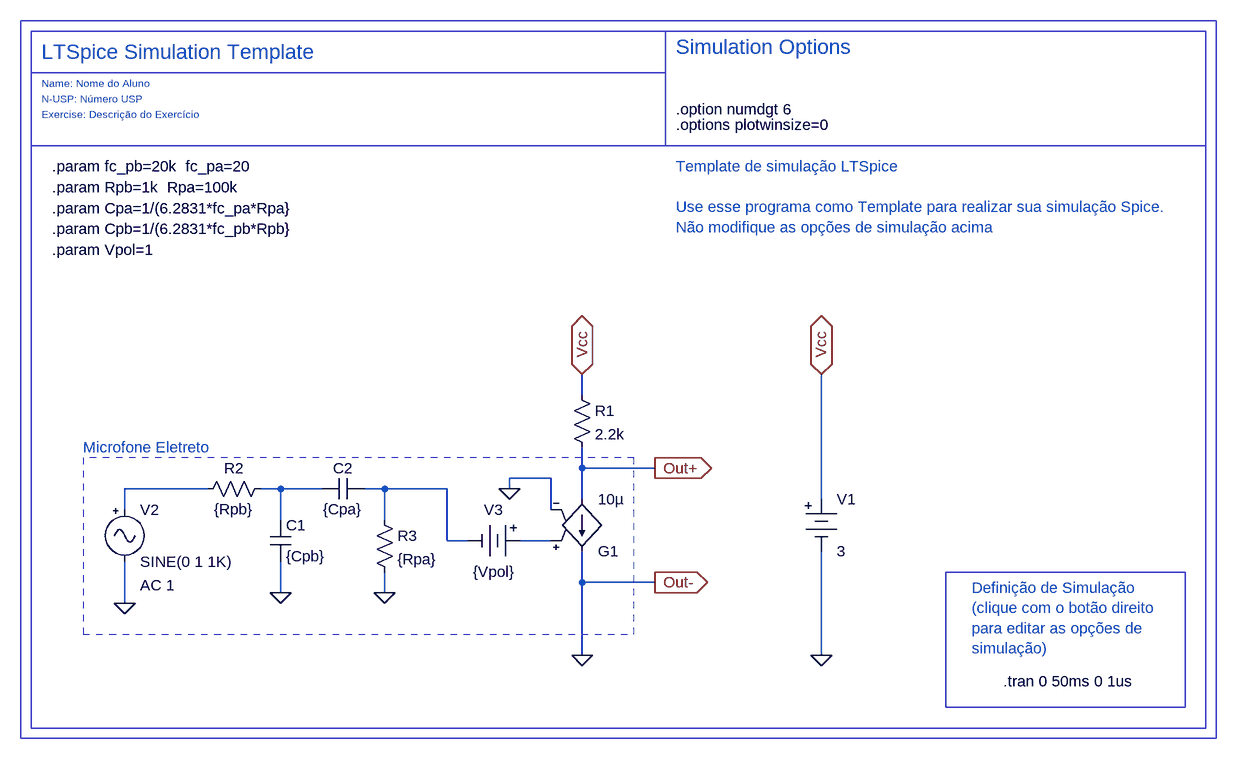
[diagram p0: schematic Basic Template.asc]
Basic Template.asc, the LTspice schematic file:
Version 4
SHEET 1 880 680
WIRE -2848 -2112 -2848 -2144
WIRE -2848 -2000 -2848 -2032
WIRE -2736 -2000 -2848 -2000
WIRE -2896 -1984 -2960 -1984
WIRE -3424 -1968 -3552 -1968
WIRE -3312 -1968 -3344 -1968
WIRE -3248 -1968 -3312 -1968
WIRE -3152 -1968 -3184 -1968
WIRE -3056 -1968 -3152 -1968
WIRE -2960 -1968 -2960 -1984
WIRE -2848 -1952 -2848 -2000
WIRE -2480 -1952 -2480 -2144
WIRE -3552 -1936 -3552 -1968
WIRE -2896 -1936 -2896 -1984
WIRE -3312 -1920 -3312 -1968
WIRE -3152 -1920 -3152 -1968
WIRE -3056 -1888 -3056 -1968
WIRE -3024 -1888 -3056 -1888
WIRE -2896 -1888 -2944 -1888
WIRE -2848 -1824 -2848 -1872
WIRE -2736 -1824 -2848 -1824
WIRE -3312 -1808 -3312 -1856
WIRE -3152 -1808 -3152 -1840
WIRE -3552 -1792 -3552 -1856
WIRE -2848 -1712 -2848 -1824
WIRE -2480 -1712 -2480 -1872
FLAG -2848 -1712 0
FLAG -2480 -1712 0
FLAG -2480 -2144 Vcc
IOPIN -2480 -2144 BiDir
FLAG -2848 -2144 Vcc
IOPIN -2848 -2144 BiDir
FLAG -2736 -2000 Out+
IOPIN -2736 -2000 Out
FLAG -2960 -1968 0
FLAG -3552 -1792 0
FLAG -3312 -1808 0
FLAG -3152 -1808 0
FLAG -2736 -1824 Out-
IOPIN -2736 -1824 Out
SYMBOL res -2864 -2128 R0
SYMATTR InstName R1
SYMATTR Value 2.2k
SYMBOL Misc\\battery -2480 -1968 R0
WINDOW 123 0 0 Left 2
WINDOW 39 0 0 Left 2
SYMATTR InstName V1
SYMATTR Value 3
SYMBOL g -2848 -1856 M180
SYMATTR InstName G1
SYMATTR Value 10µ
SYMBOL Misc\\signal -3552 -1952 R0
WINDOW 123 24 132 Left 2
SYMATTR Value2 AC 1
SYMATTR InstName V2
SYMBOL res -3328 -1984 R90
WINDOW 0 0 56 VBottom 2
WINDOW 3 32 56 VTop 2
SYMATTR InstName R2
SYMATTR Value {Rpb}
SYMBOL cap -3328 -1920 R0
SYMATTR InstName C1
SYMATTR Value {Cpb}
SYMBOL cap -3184 -1984 R90
WINDOW 0 0 32 VBottom 2
WINDOW 3 32 32 VTop 2
SYMATTR InstName C2
SYMATTR Value {Cpa}
SYMBOL res -3168 -1936 R0
SYMATTR InstName R3
SYMATTR Value {Rpa}
SYMBOL Misc\\battery -2928 -1888 R90
WINDOW 0 -32 56 VBottom 2
WINDOW 3 32 56 VTop 2
SYMATTR InstName V3
SYMATTR Value {Vpol}
TEXT -2704 -2648 Left 3 ;Simulation Options
TEXT -3680 -2640 Left 3 ;LTSpice Simulation Template
TEXT -3680 -2592 Left 1 ;Name: Nome do Aluno
TEXT -3680 -2544 Left 1 ;Exercise: Descrição do Exercício
TEXT -3680 -2568 Left 1 ;N-USP: Número USP
TEXT -2704 -2528 Left 2 !.options plotwinsize=0
TEXT -2704 -2552 Left 2 !.option numdgt 6
TEXT -2200 -1672 Left 2 !.tran 0 50ms 0 1us
TEXT -3664 -2464 Left 2 !.param fc_pb=20k  fc_pa=20
TEXT -3664 -2368 Left 2 !.param Cpb=1/(6.2831*fc_pb*Rpb}
TEXT -3664 -2400 Left 2 !.param Cpa=1/(6.2831*fc_pa*Rpa}
TEXT -3664 -2432 Left 2 !.param Rpb=1k  Rpa=100k
TEXT -3664 -2336 Left 2 !.param Vpol=1
TEXT -3616 -2032 Left 2 ;Microfone Eletreto
TEXT -2248 -1816 Left 2 ;Definição de Simulação\n(clique com o botão direito\npara editar as opções de \nsimulação)
TEXT -2704 -2464 Left 2 ;Template de simulação LTSpice\n \nUse esse programa como Template para realizar sua simulação Spice.\nNão modifique as opções de simulação acima
RECTANGLE Normal -2720 -2608 -3696 -2672
RECTANGLE Normal -2720 -2496 -3696 -2608
RECTANGLE Normal -1888 -2496 -2720 -2672
RECTANGLE Normal -1888 -1600 -3696 -2496
RECTANGLE Normal -3712 -2688 -3712 -2688 2
RECTANGLE Normal -1872 -1584 -3712 -2688
RECTANGLE Normal -3616 -1744 -2768 -2016 2
RECTANGLE Normal -2288 -1840 -1920 -1632

The netlist it stands for:
* Basic Template.asc
R1 Vcc Out+ 2.2k
V1 Vcc 0 3
G1 Out+ 0 N004 0 10µ
V2 N001 0 SINE(0 1 1K) AC 1
R2 N002 N001 {Rpb}
C1 N002 0 {Cpb}
C2 N003 N002 {Cpa}
R3 N003 0 {Rpa}
V3 N004 N003 {Vpol}
* Simulation Options
* LTSpice Simulation Template
* Name: Nome do Aluno
* Exercise: Descrição do Exercício
* N-USP: Número USP
.options plotwinsize=0
.option numdgt 6
.tran 0 50ms 0 1us
.param fc_pb=20k  fc_pa=20
.param Cpb=1/(6.2831*fc_pb*Rpb}
.param Cpa=1/(6.2831*fc_pa*Rpa}
.param Rpb=1k  Rpa=100k
.param Vpol=1
* Microfone Eletreto
* Definição de Simulação
* (clique com o botão direito
* para editar as opções de
* simulação)
* Template de simulação LTSpice
* Use esse programa como Template para realizar sua simulação Spice.
* Não modifique as opções de simulação acima
.backanno
.end